# Altium project Connect_PCB.PrjPcb
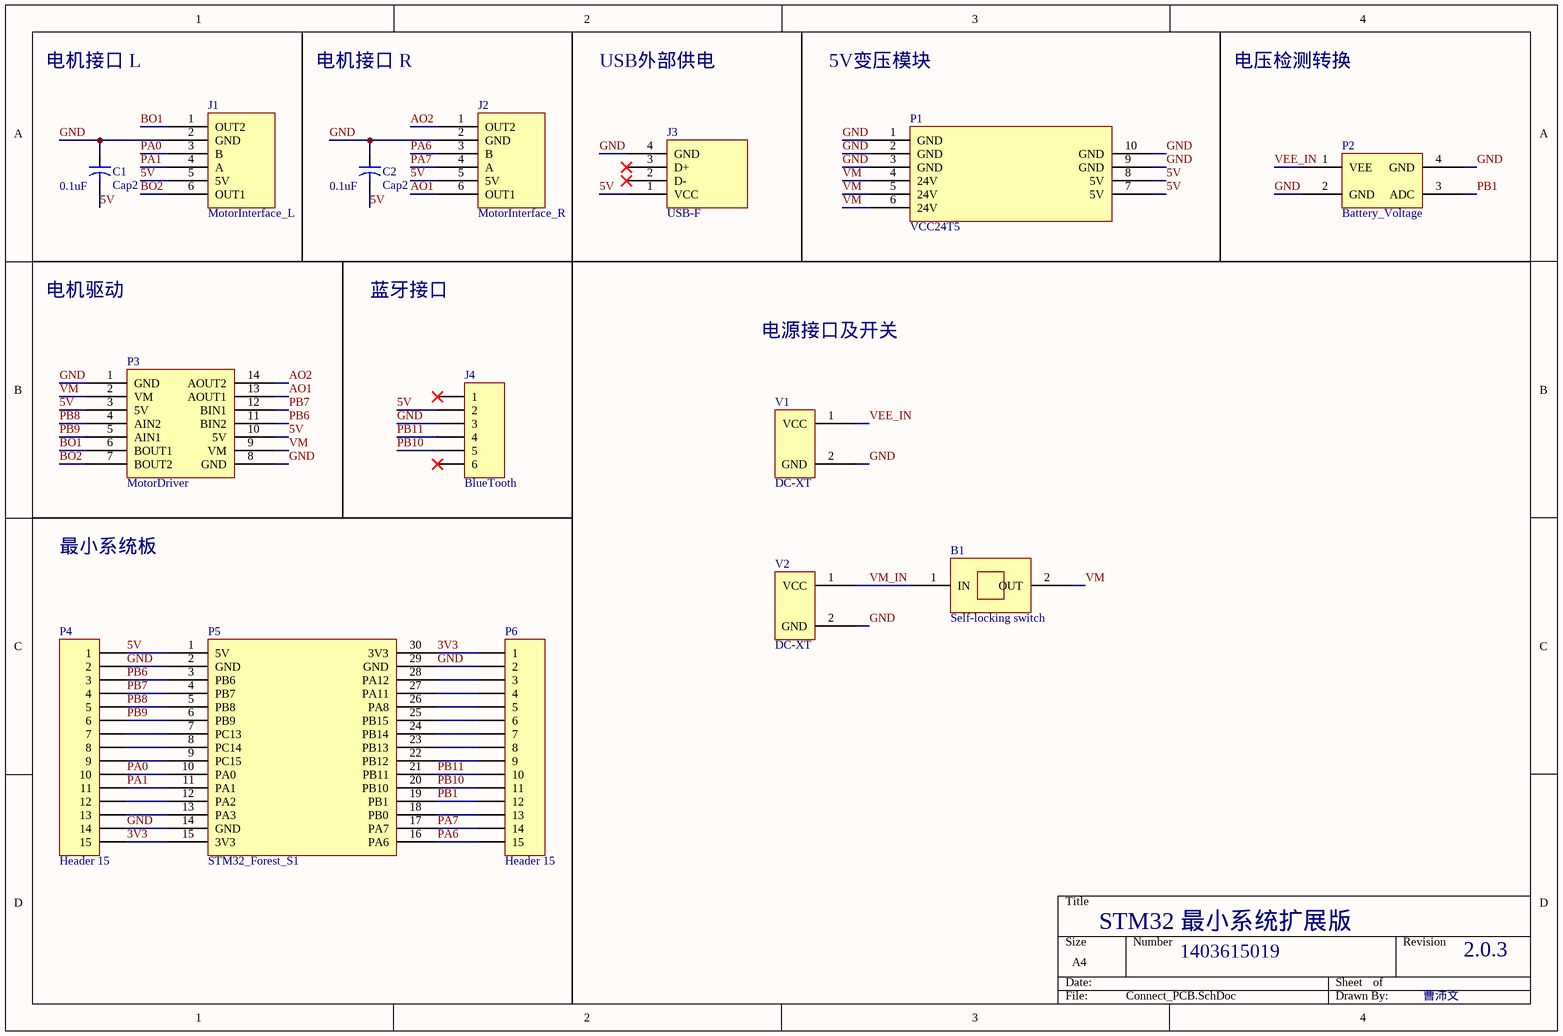
[diagram p0: Connect_PCB.SchDoc]
1 sheet, 15 parts. Net scope: global (net labels, ports and power ports of the same name join across sheets).
Board file: Connect_PCB.PcbDoc

## Sheet Connect_PCB.SchDoc: STM32最小系统拓展板
size A4; Date: 2018/4/14; Revision: 1.0.1

### Parts
B1  Self-locking switch  [Self-locking switch]
C1  Cap2  value 0.1uF  [CAPR5-4X5]
C2  Cap2  value 0.1uF  [CAPR5-4X5]
J1  MotorInterface_L  [MotorInterface]
J2  MotorInterface_R  [MotorInterface]
J3  USB-F  [USB-F]
J4  BlueTooth  [HDR1X6]
P1  VCC24T5  [VCC24T5]
P2  Battery_Voltage  [PCBComponent_1]
P3  MotorDriver  [Motor Driver]
P4  Header 15  [HDR1X15]
P5  STM32_Forest_S1  [STM32_Forest_S1]
P6  Header 15  [HDR1X15]
V1  DC-XT  [DC_XT]
V2  DC-XT  [DC_XT]

### Nets
3V3: P4.15 P5.15(3V3) P5.30(3V3) P6.1
5V: C1.2 C2.2 J1.5(5V) J2.5(5V) J3.1(VCC) J4.2 P1.7(5V) P1.8(5V) P3.3(5V) P3.10(5V) P4.1 P5.1(5V)
AO1: J2.6(OUT1) P3.13(AOUT1)
AO2: J2.1(OUT2) P3.14(AOUT2)
BO1: J1.1(OUT2) P3.6(BOUT1)
BO2: J1.6(OUT1) P3.7(BOUT2)
GND: C1.1 C2.1 J1.2(GND) J2.2(GND) J3.4(GND) J4.3 P1.1(GND) P1.2(GND) P1.3(GND) P1.9(GND) P1.10(GND) P2.2(GND) P2.4(GND) P3.1(GND) P3.8(GND) P4.2 P4.14 P5.2(GND) P5.14(GND) P5.29(GND) P6.2 V1.2(GND) V2.2(GND)
PA0: J1.3(B) P4.10 P5.10(PA0)
PA1: J1.4(A) P4.11 P5.11(PA1)
PA6: J2.3(B) P5.16(PA6) P6.15
PA7: J2.4(A) P5.17(PA7) P6.14
PB1: P2.3(ADC) P5.19(PB1) P6.12
PB6: P3.11(BIN2) P4.3 P5.3(PB6)
PB7: P3.12(BIN1) P4.4 P5.4(PB7)
PB8: P3.4(AIN2) P4.5 P5.5(PB8)
PB9: P3.5(AIN1) P4.6 P5.6(PB9)
PB10: J4.5 P5.20(PB10) P6.11
PB11: J4.4 P5.21(PB11) P6.10
VEE_IN: P2.1(VEE) V1.1(VCC)
VM: B1.2(OUT) P1.4(24V) P1.5(24V) P1.6(24V) P3.2(VM) P3.9(VM)
VM_IN: B1.1(IN) V2.1(VCC)
NetP4_7: P4.7 P5.7(PC13)
NetP4_8: P4.8 P5.8(PC14)
NetP4_9: P4.9 P5.9(PC15)
NetP4_12: P4.12 P5.12(PA2)
NetP4_13: P4.13 P5.13(PA3)
NetP5_18: P5.18(PB0) P6.13
NetP5_22: P5.22(PB12) P6.9
NetP5_23: P5.23(PB13) P6.8
NetP5_24: P5.24(PB14) P6.7
NetP5_25: P5.25(PB15) P6.6
NetP5_26: P5.26(PA8) P6.5
NetP5_27: P5.27(PA11) P6.4
NetP5_28: P5.28(PA12) P6.3

Not connected (* = marked no-connect by the designer): J3 2(D-)* 3(D+)*; J4 1* 6*

### Notes on the sheet
- 电机接口 L
- 电机接口 R
- USB外部供电
- 5V变压模块
- 电压检测转换
- 电机驱动
- 蓝牙接口
- 电源接口及开关
- 最小系统板
- STM32 最小系统扩展版
- 1403615019
- 2.0.3
- 曹沛文

### Library data of the parts
C1 C2 = Cap2: Capacitor; Published: 23-Sep-2002; PackageReference: CAPR5-4X5; Publisher: Altium Limited; PackageDescription: Capacitor; 2 Leads
J1 J2 = MotorInterface
J4 = Header 6: Header, 6-Pin; LatestRevisionDate: 17-Jul-2002; LatestRevisionNote: Re-released for DXP Platform.; Publisher: Altium Limited
P4 P6 = Header 15: Header, 15-Pin; LatestRevisionDate: 17-Jul-2002; LatestRevisionNote: Re-released for DXP Platform.; Publisher: Altium Limited